# Altium schematic sheet Instruction Register.SchDoc
size B; Author: E. Sims; Organization: Let's Build Rockets Inc.; SheetNumber: 7; SheetTotal: 17
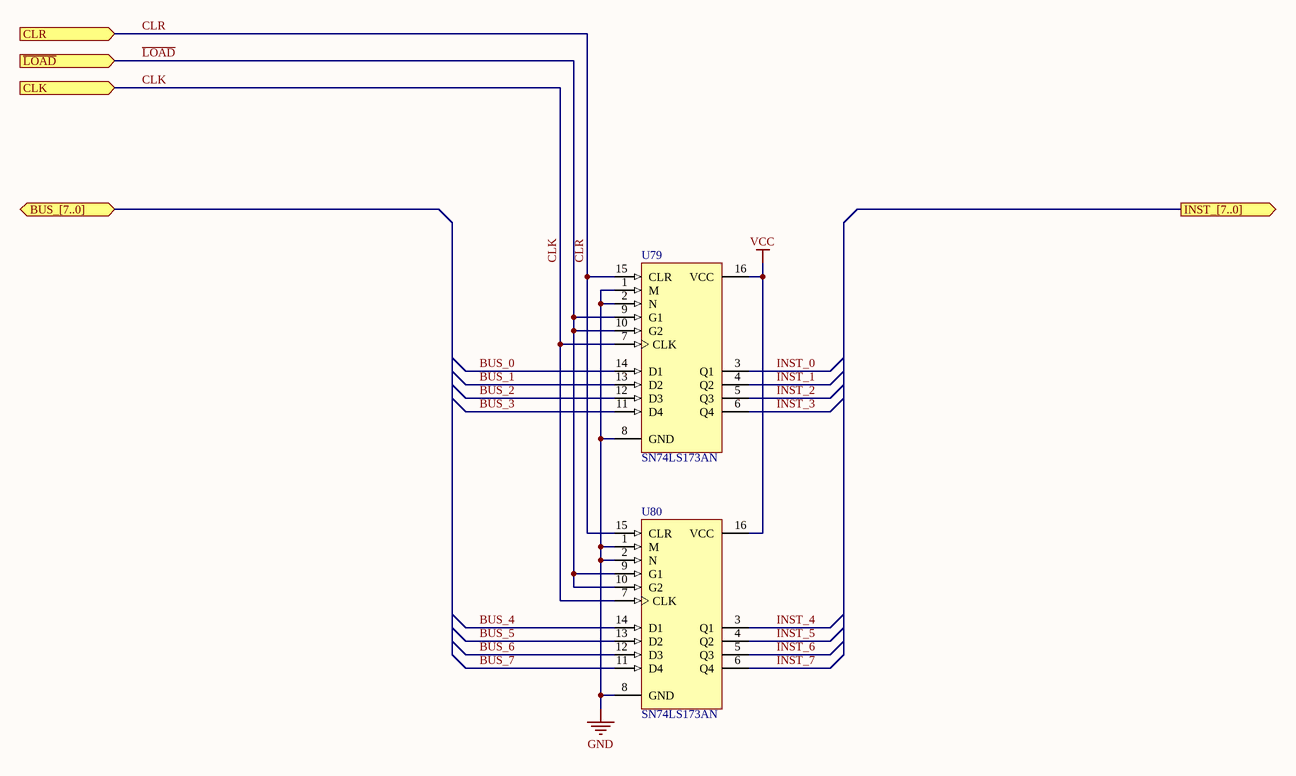
[diagram p0: Instruction Register.SchDoc]

## Parts
U79  SN74LS173AN  [N016D]
U80  SN74LS173AN  [N016D]

## Ports
BUS_[7..0] (bidir), CLK (in), CLR (in), INST_[7..0] (out), ~{LOAD} (in)

## Nets
GND: U79.1(M) U79.2(N) U79.8(GND) U80.1(M) U80.2(N) U80.8(GND)
VCC: U79.16(VCC) U80.16(VCC)
BUS_0: U79.14(D1)
BUS_1: U79.13(D2)
BUS_2: U79.12(D3)
BUS_3: U79.11(D4)
BUS_4: U80.14(D1)
BUS_5: U80.13(D2)
BUS_6: U80.12(D3)
BUS_7: U80.11(D4)
CLK: U79.7(CLK) U80.7(CLK) ; port CLK
CLR: U79.15(CLR) U80.15(CLR) ; port CLR
INST_0: U79.3(Q1)
INST_1: U79.4(Q2)
INST_2: U79.5(Q3)
INST_3: U79.6(Q4)
INST_4: U80.3(Q1)
INST_5: U80.4(Q2)
INST_6: U80.5(Q3)
INST_7: U80.6(Q4)
~{LOAD}: U79.9(G1) U79.10(G2) U80.9(G1) U80.10(G2) ; port ~{LOAD}

## Notes on the sheet
- Let's Build Rocket's Inc. Modular Paylaod System Based on TMP-010 Rev
  For more information visit https://github.com/LetsBuildRockets/Modular-Payload-System
  This work is licensed under CC BY-NC 4.0. To view a copy of this license, visit https://creativecommons.org/licenses/by-nc/4.0
- Title
- Size:
- Date:
- Assembly Variant:
- B
- Number:
- Time:
- Revision:
- Sheet
- of
- Author:
- File:

## Library data of the parts
U79 U80 = SN74LS173AN: 4-Bit D-Type Register with 3-State Outputs; Published: 8-Jun-2000; LatestRevisionDate: 04-Mar-2005; LatestRevisionNote: Stylized 3D Model Added.; DatasheetVersion: Mar-1988; PackageVersion: Oct-1995; PackageReference: N016D; Publisher: Altium Limited; PackageDescription: DIP; 16 Leads; Row Spacing 7.62 mm; Pitch 2.54 mm; Code_JEDEC: MS-001-BB; ComponentLink1Description: Manufacturer Link; ComponentLink1URL: http://www.ti.com/; ComponentLink2Description: Datasheet; ComponentLink2URL: http://www-s.ti.com/sc/ds/sn74ls173a.pdf